# EAGLE design oblatkovac (EAGLE 9.6.2)
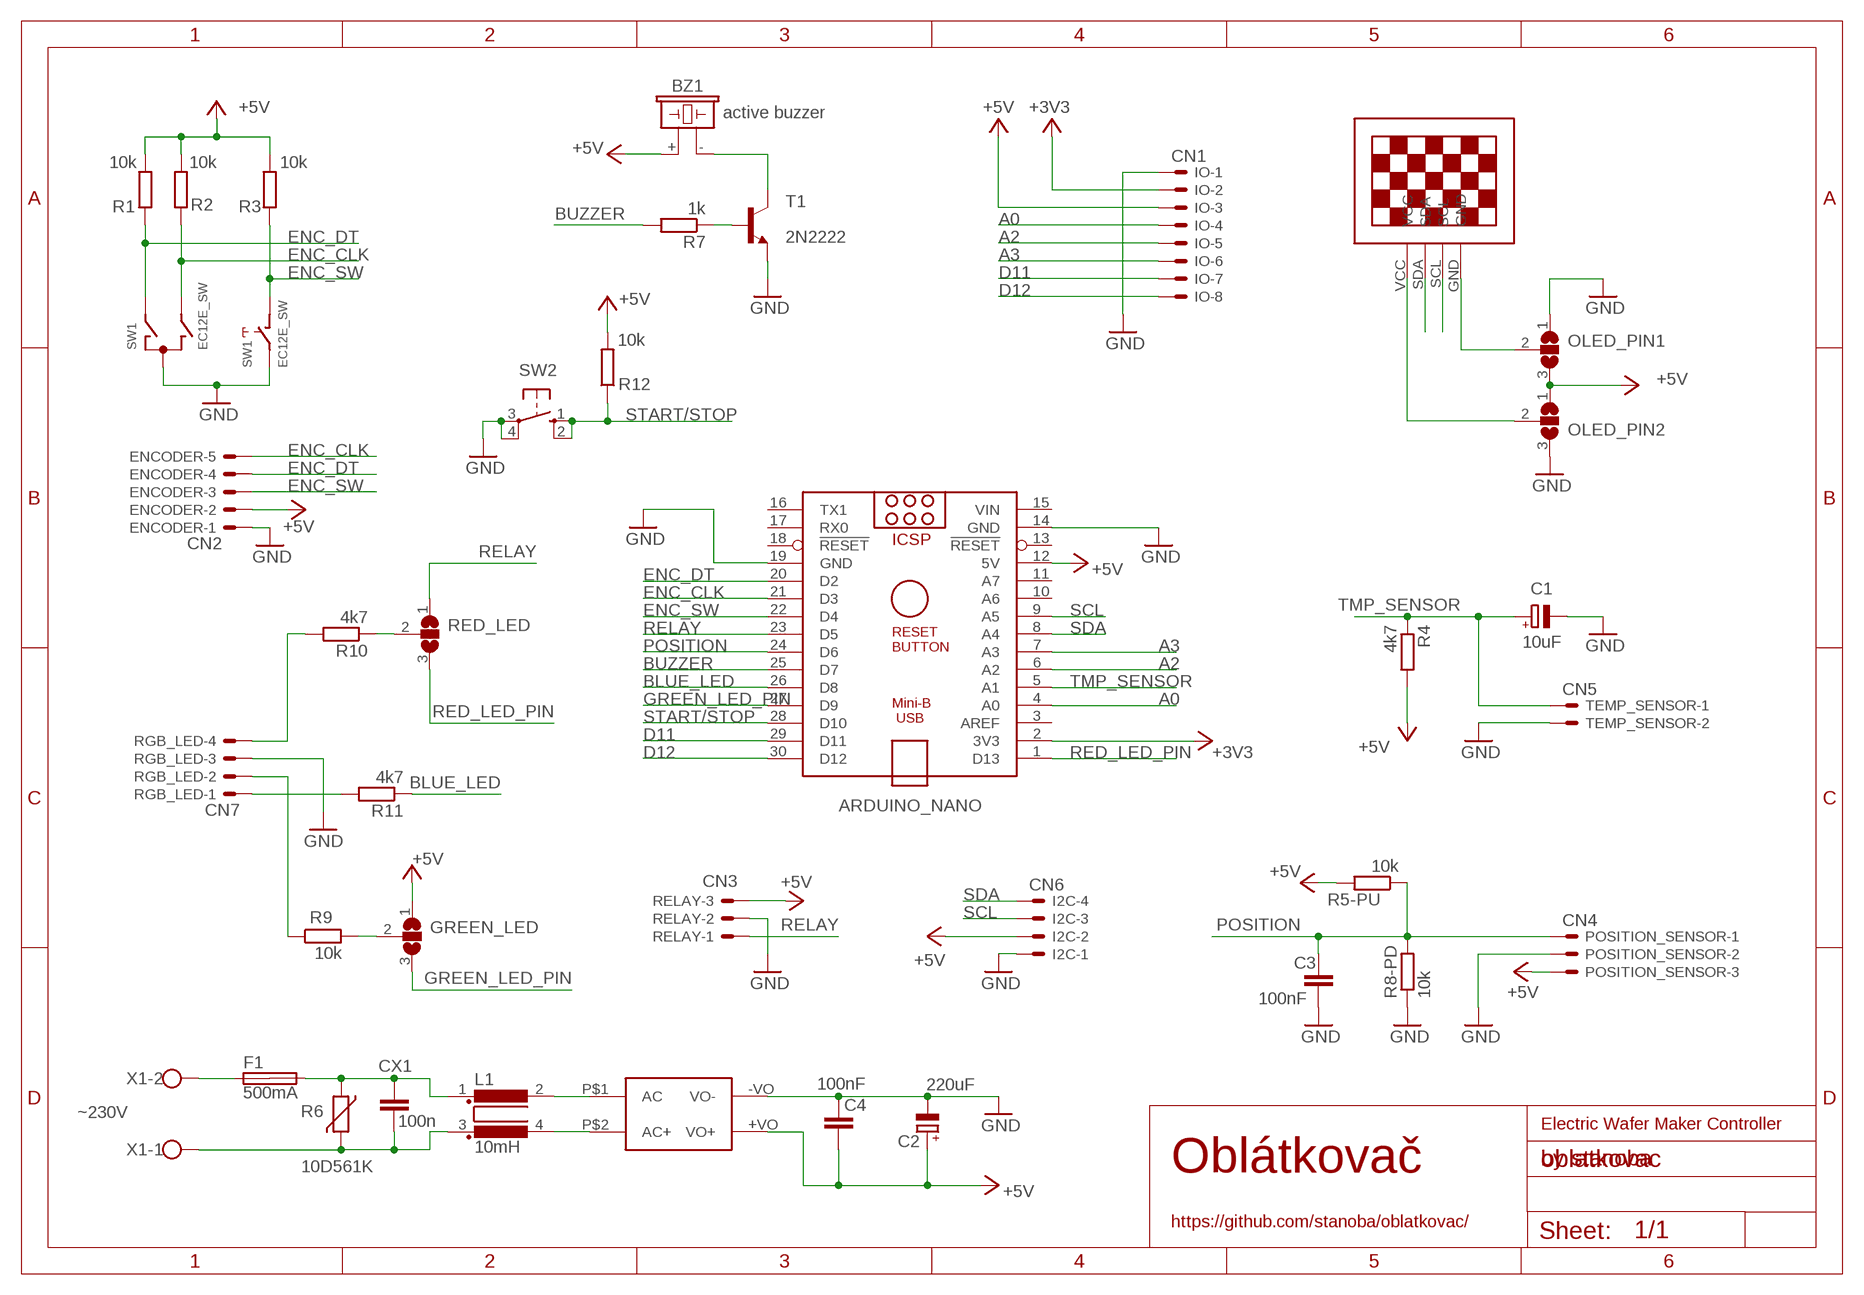
[diagram p0: schematic, sheet 1]

## Parts
ARDUINO_NANO  ARDUINO_NANO  [ARDUINO_NANO]
BZ1  active buzzer  F/CM12P  [F/CM12P]
C1  10uF  CPOL-EUE5-6  [E5-6]
C2  220uF  CPOL-EUE5-10.5  [E5-10,5]
C3  100nF  C-EU050-024X044  [C050-024X044]
C4  100nF  C-EU050-024X044  [C050-024X044]
CX1  100n  CXXC10B6  [XC10B6]
ENCODER  CN2  JST-XH-05-PIN-LONG-PAD  [JST-XH-05-PACKAGE-LONG-PAD]
F1  500mA  SHK20L  [SHK20L]
GREEN_LED  SJ2W  [SJ_2]
I2C  CN6  JST-XH-04-PIN-LONG-PAD  [JST-XH-04-PACKAGE-LONG-PAD]
IO  CN1  JST-XH-08-PIN-LONG-PAD  [JST-XH-08-PACKAGE-LONG-PAD]
L1  10mH  R1405XB2  [B2]
OLED_PIN1  SJ2W  [SJ_2]
OLED_PIN2  SJ2W  [SJ_2]
POSITION_SENSOR  CN4  JST-XH-03-PIN-LONG-PAD  [JST-XH-03-PACKAGE-LONG-PAD]
R1  10k  R-EU_0207/10  [0207/10]
R2  10k  R-EU_0207/10  [0207/10]
R3  10k  R-EU_0207/10  [0207/10]
R4  4k7  R-EU_0207/10  [0207/10]
R5-PU  10k  R-EU_0207/10  [0207/10]
R6  10D561K  VARISTOR-7,5  [R-7,5]
R7  1k  R-EU_0207/10  [0207/10]
R8-PD  10k  R-EU_0207/10  [0207/10]
R9  10k  R-EU_0207/10  [0207/10]
R10  4k7  R-EU_0207/10  [0207/10]
R11  4k7  R-EU_0207/10  [0207/10]
R12  10k  R-EU_0207/10  [0207/10]
RED_LED  SJ2W  [SJ_2]
RELAY  CN3  JST-XH-03-PIN-LONG-PAD  [JST-XH-03-PACKAGE-LONG-PAD]
RGB_LED  CN7  JST-XH-04-PIN-LONG-PAD  [JST-XH-04-PACKAGE-LONG-PAD]
SW1  EC12E_SW  [ALPS_EC12E_SW]
SW2  10-XX  [B3F-10XX]
T1  2N2222  -NPN-TO92-EBC  [TO92-EBC]
TEMP_SENSOR  CN5  JST-XH-02-PIN-LONG-PAD  [JST-XH-02-PACKAGE-LONG-PAD]
U$1  13"OLED13"OLED  [1.3"OLED]
U$2  HLK-5M05  [HLK-5M05]
X1  ~230V  W237-102  [W237-102]

## Nets
+3V3: ARDUINO_NANO.2(3V3) IO.2
+5V [5V]: ARDUINO_NANO.12(5V) BZ1.+ C2.+ C4.2 ENCODER.2 GREEN_LED.1 I2C.2 IO.3 OLED_PIN1.3 OLED_PIN2.1 POSITION_SENSOR.3 R1.2 R2.2 R3.2 R4.2 R5-PU.2 R12.2 RELAY.3 U$2.+VO(VO+)
A0: ARDUINO_NANO.4(A0) IO.4
A2: ARDUINO_NANO.6(A2) IO.5
A3: ARDUINO_NANO.7(A3) IO.6
BLUE_LED: ARDUINO_NANO.26(D8) R11.1
BUZZER: ARDUINO_NANO.25(D7) R7.2
D11: ARDUINO_NANO.29(D11) IO.7
D12: ARDUINO_NANO.30(D12) IO.8
ENC_CLK: ARDUINO_NANO.21(D3) ENCODER.5 R2.1 SW1.B
ENC_DT: ARDUINO_NANO.20(D2) ENCODER.4 R1.1 SW1.A
ENC_SW: ARDUINO_NANO.22(D4) ENCODER.3 R3.1 SW1.D
GND [GND]: ARDUINO_NANO.14(GND) ARDUINO_NANO.19(GND) C1.- C2.- C3.2 C4.1 ENCODER.1 I2C.1 IO.1 OLED_PIN1.1 OLED_PIN2.3 POSITION_SENSOR.2 R8-PD.1 RELAY.2 RGB_LED.3 SW1.C SW1.E SW2.3(P) SW2.4(P1) T1.E TEMP_SENSOR.2 U$2.-VO(VO-)
GREEN_LED_PIN: ARDUINO_NANO.27(D9) GREEN_LED.3
LIVE_FUSED [high voltage]: F1.1A X1.2
LIVE_FUSED2 [high voltage]: CX1.1 F1.2A L1.1 R6.1
LIVE_FUSED3 [high voltage]: L1.2 U$2.P$1(AC)
N$1: R11.2 RGB_LED.1
N$2: GREEN_LED.2 R9.2
N$5: R9.1 RGB_LED.2
N$6: R10.2 RGB_LED.4
N$11: BZ1.- T1.C
N$12: R7.1 T1.B
N$14: R10.1 RED_LED.2
NEUTRAL [high voltage]: CX1.2 L1.3 R6.2 X1.1
NEUTRAL2 [high voltage]: L1.4 U$2.P$2(AC+)
OLED_PIN1: OLED_PIN1.2 U$1.GND
OLED_PIN2: OLED_PIN2.2 U$1.VCC
POSITION: ARDUINO_NANO.24(D6) C3.1 POSITION_SENSOR.1 R5-PU.1 R8-PD.2
RED_LED_PIN: ARDUINO_NANO.1(D13) RED_LED.3
RELAY: ARDUINO_NANO.23(D5) RED_LED.1 RELAY.1
SCL: ARDUINO_NANO.9(A5) I2C.3 U$1.SCL
SDA: ARDUINO_NANO.8(A4) I2C.4 U$1.SDA
START/STOP: ARDUINO_NANO.28(D10) R12.1 SW2.1(S) SW2.2(S1)
TMP_SENSOR: ARDUINO_NANO.5(A1) C1.+ R4.1 TEMP_SENSOR.1
Unconnected: ARDUINO_NANO.3(AREF) ARDUINO_NANO.10(A6) ARDUINO_NANO.11(A7) ARDUINO_NANO.13(!RESET) ARDUINO_NANO.16(TX1) ARDUINO_NANO.17(RX0) ARDUINO_NANO.18(!RESET) F1.1B F1.2B SW1.GND1(G) SW1.GND2(G)

## Notes on the sheet
- Electric Wafer Maker Controller
- by stanoba
- Oblátkovač
- https://github.com/stanoba/oblatkovac/

## Power pins joined to a net without a drawn wire
VIN: ARDUINO_NANO.15(VIN)

## Library data of the parts
ARDUINO_NANO = ArduinoNanoV30:ARDUINO_NANO: Arduino Nano V3.0 Overview: The Arduino Nano is a small, complete, and breadboard-friendly board based on the ATmega328 (Arduino Nano 3.x) or ATmega168 (Arduino Nano 2.x). It has more or less the same functionality of the Arduino Duemilanove, but in a different package. It lacks only a DC power jack, and works with a Mini-B USB cable instead of a standard one. The Nano was designed and is being produced by Gravitech. Specifications: Microcontroller Atmel ATmega168 or ATmega328 Operating Voltage (logic level) 5 V Input Voltage (recommended) 7-12 V Input Voltage (limits) 6-20 V Digital I/O Pins 14 (of which 6 provide PWM output) Analog Input Pins 8 DC Current per I/O Pin 40 mA Flash Memory 16 KB (ATmega168) or 32 KB (ATmega328) of which 2 KB used by bootloader SRAM 1 KB (ATmega168) or 2 KB (ATmega328) EEPROM 512 bytes (ATmega168) or 1 KB (ATmega328) Clock Speed 16 MHz Dimensions 0.73" x 1.70" Length 45 mm Width 18 mm Weigth 5 g Power: The Arduino Nano can be powered via the Mini-B USB connection, 6-20V unregulated external power supply (pin 30), or 5V regulated external power supply (pin 27). The power source is automatically selected to the highest voltage source. Memory: The ATmega168 has 16 KB of flash memory for storing code (of which 2 KB is used for the bootloader); the ATmega328 has 32 KB, (also with 2 KB used for the bootloader). The ATmega168 has 1 KB of SRAM and 512 bytes of EEPROM (which can be read and written with the EEPROM library); the ATmega328 has 2 KB of SRAM and 1 KB of EEPROM. Input and Output: Each of the 14 digital pins on the Nano can be used as an input or output, using pinMode(), digitalWrite(), and digitalRead() functions. They operate at 5 volts. Each pin can provide or receive a maximum of 40 mA and has an internal pull-up resistor (disconnected by default) of 20-50 kOhms. In addition, some pins have specialized functions. Visit Arduino - ArduinoBoardNano <https://www.arduino.cc/en/Main/ArduinoBoardNano>
BZ1 = buzzer:F/CM12P: BUZZER Source: Buerklin; OC_FARNELL: unknown; OC_NEWARK: unknown
C1 C2 = rcl:CPOL-EU: POLARIZED CAPACITOR, European symbol; SPICEPREFIX: C
C3 C4 = rcl:C-EU: CAPACITOR, European symbol; SPICEPREFIX: C
CX1 = rcl:CX: X CAPACITOR for power line; SPICEPREFIX: C
ENCODER = Rembrandt Electronics - JST XH Connectors v1-0:JST-XH-05-PIN: JST XH Connector 2 Pin Wire to board connector. Pitch: 2,54 mm, (0.100") Number of pins: 5 Created by Rembrandt Electronics www.rembrandtelectronics.com
F1 = fuse:SHK20L: FUSE HOLDER 5 x 20 mm, SH contact, SHH1 Schukat, E1073 Buerklin; OC_FARNELL: unknown; OC_NEWARK: unknown
GREEN_LED OLED_PIN1 OLED_PIN2 RED_LED = jumper:SJ2W: SMD solder JUMPER
I2C RGB_LED = Rembrandt Electronics - JST XH Connectors v1-0:JST-XH-04-PIN: JST XH Connector 2 Pin Wire to board connector. Pitch: 2,54 mm, (0.100") Number of pins: 4 Created by Rembrandt Electronics www.rembrandtelectronics.com
IO = Rembrandt Electronics - JST XH Connectors v1-0:JST-XH-08-PIN: JST XH Connector 2 Pin Wire to board connector. Pitch: 2,54 mm, (0.100") Number of pins: 8 Created by Rembrandt Electronics www.rembrandtelectronics.com
L1 = inductor-nkl:R1405X: Gleichtakt-Entstördrossel (bis typ. 10MHz) common mode choke (up to typ. 10MHz); OC_FARNELL: unknown; OC_NEWARK: unknown
POSITION_SENSOR RELAY = Rembrandt Electronics - JST XH Connectors v1-0:JST-XH-03-PIN: JST XH Connector 2 Pin Wire to board connector. Pitch: 2,54 mm, (0.100") Number of pins: 3 Created by Rembrandt Electronics www.rembrandtelectronics.com
R1-R4 R5-PU R7 R8-PD R9-R12 = rcl:R-EU_: RESISTOR, European symbol; SPICEPREFIX: R
R6 = varistor:VARISTOR: VARISTOR
SW1 = switch-alps:EC12E_SW: ALPS rotary Encoder EC12E series with switch; MPN: EC12E2424407; OC_FARNELL: 1520813; OC_NEWARK: 74M1068
SW2 = switch-omron:10-XX: OMRON SWITCH; MPN: B3F-1000; OC_FARNELL: 176432; OC_NEWARK: 36M3542
T1 = transistor:*-NPN-: NPN Transistror BF959 corrected 2008.03.06
TEMP_SENSOR = Rembrandt Electronics - JST XH Connectors v1-0:JST-XH-02-PIN: JST XH Connector 2 Pin Wire to board connector. Pitch: 2,54 mm, (0.100") Number of pins: 2 Created by Rembrandt Electronics www.rembrandtelectronics.com
U$1 = 13oled:13"OLED
U$2 = mastrogippo:HLK-5M05
X1 = con-wago-500:W237-102: WAGO SCREW CLAMP; MPN: 237-102; OC_FARNELL: unknown; OC_NEWARK: 70K9898

## Net classes
0 default: clearance 0.3 mm
1 high voltage: width 4 mm, clearance 1.5 mm
2 5V: width 1 mm, clearance 0.3 mm
3 GND: width 1 mm, clearance 0.3 mm

## Board
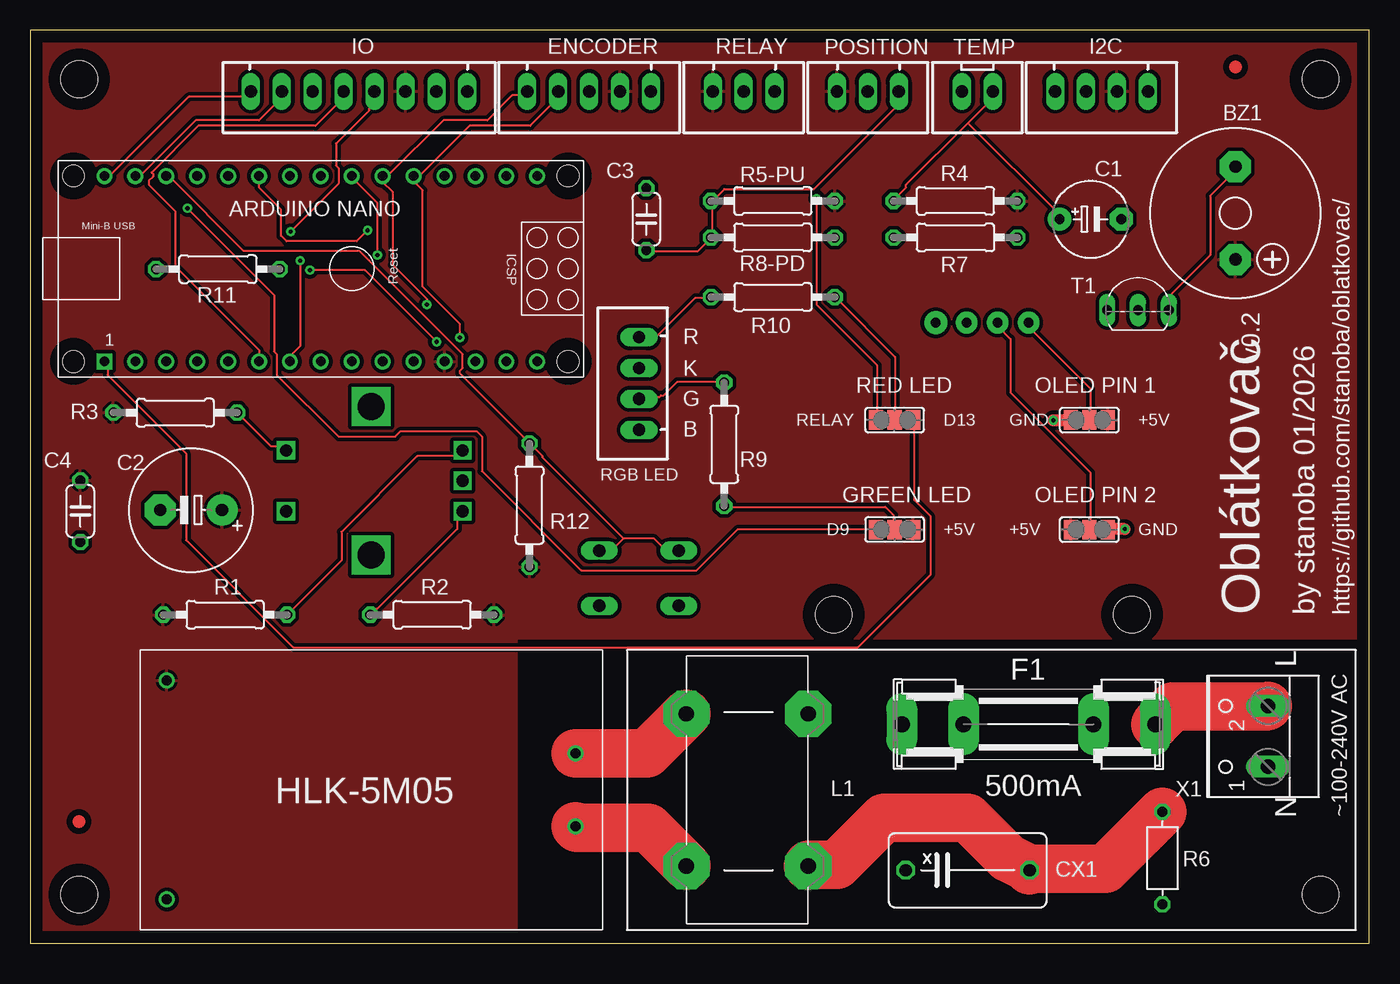
[diagram p1: board, top side]
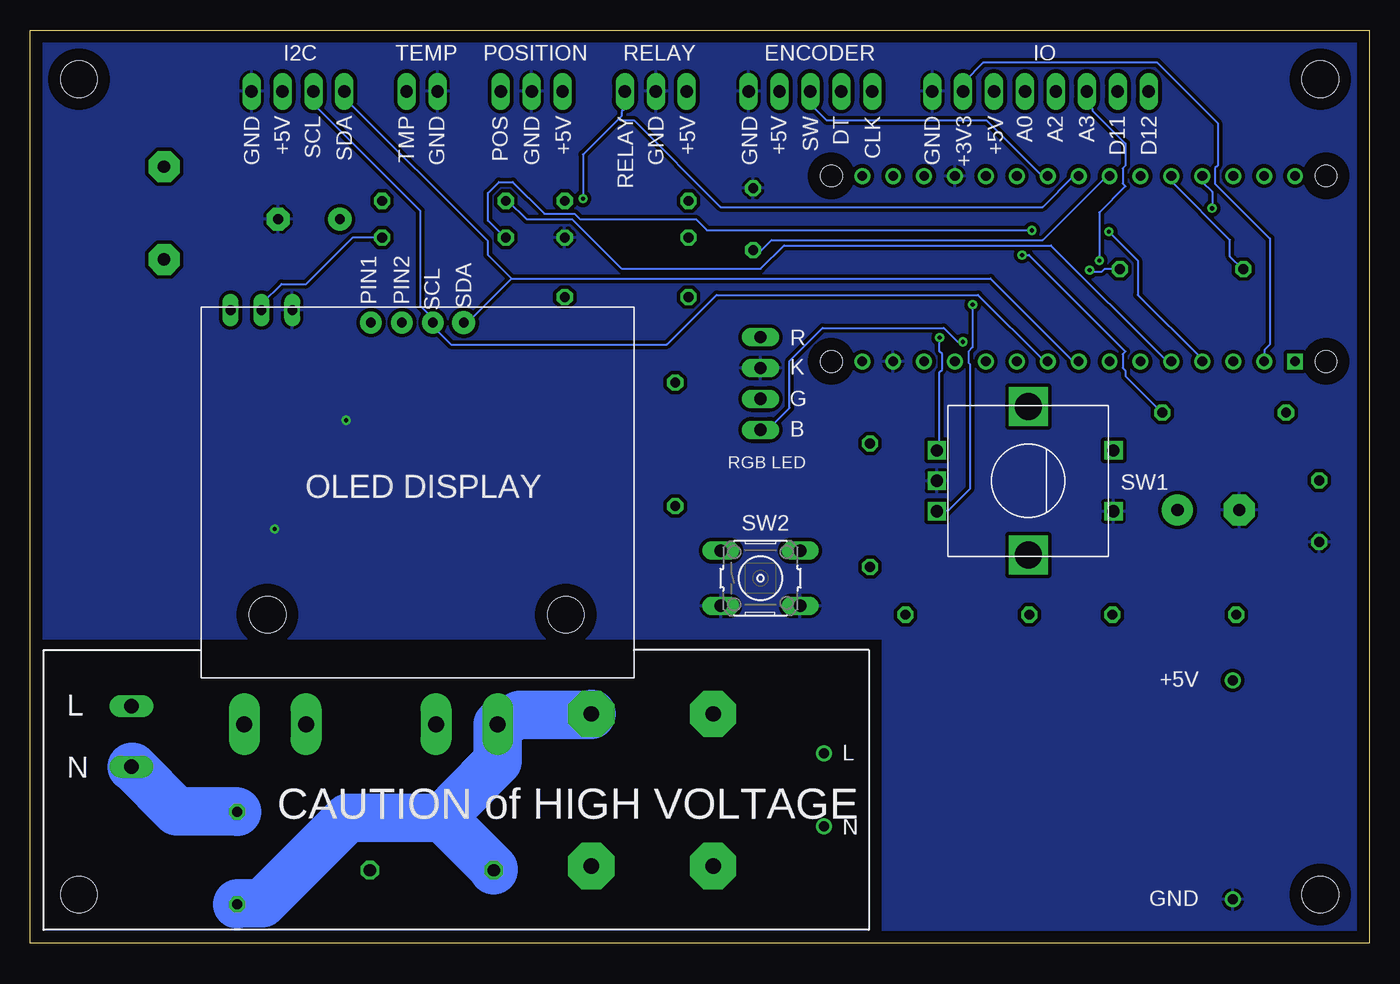
[diagram p2: board, bottom side, seen from below]

Size 109.98 x 75.01 mm. Coordinates in mm from the lower left corner, seen from the top.
Outline: 0,0 109.98,0 109.98,75.01 0,75.01 0,0
Copper layers (1*16): Top 0.035mm / dielectric 1.5mm / Bottom 0.035mm
Design rules "default": minimum track width 6mil, minimum drill 0.35mm, track to track 6mil, track to pad 6mil, pad to pad 6mil, via to via 6mil, smd to smd 6mil, copper to edge 40mil, drill to drill 6mil, minimum pad ring 10mil, minimum via ring 8mil, stop-mask expansion 4mil, vias tented up to drill 0mil, thermal gap 10mil
Holes 3 mm at 4,4 4,71 106,4 106,71 66,27 90.5,27

### Footprints (pad centres in the part's own frame; a part is rotated, then mirrored left to right if it is on the bottom)
ARDUINO_NANO = drill 0.8 square: 1 -20.32,-7.62 | drill 0.8: 2 -17.78,-7.62; 3 -15.24,-7.62; 4 -12.7,-7.62; 5 -10.16,-7.62; 6 -7.62,-7.62; 7 -5.08,-7.62; 8 -2.54,-7.62; 9 0,-7.62; 10 2.54,-7.62; 11 5.08,-7.62; 12 7.62,-7.62; 13 10.16,-7.62; 14 12.7,-7.62; 15 15.24,-7.62; 16 15.24,7.62; 17 12.7,7.62; 18 10.16,7.62; 19 7.62,7.62; 20 5.08,7.62; 21 2.54,7.62; 22 0,7.62; 23 -2.54,7.62; 24 -5.08,7.62; 25 -7.62,7.62; 26 -10.16,7.62; 27 -12.7,7.62; 28 -15.24,7.62; 29 -17.78,7.62; 30 -20.32,7.62 | hole 1.778: -22.86,-7.62; -22.86,7.62; 17.78,7.62; 17.78,-7.62
F/CM12P = drill 1.016 pad 2.54 octagon: + 3.81,0; - -3.81,0
E5-6 = drill 0.813 pad 1.905: + -2.54,0 | drill 0.813 pad 1.905 octagon: - 2.54,0
E5-10,5 = drill 1.016 pad 2.54: + -2.54,0 | drill 1.016 pad 2.54 octagon: - 2.54,0
C050-024X044 = drill 0.813 octagon: 1 -2.54,0; 2 2.54,0
XC10B6 = drill 1.016 octagon: 1 -5.08,0; 2 5.08,0
JST-XH-05-PACKAGE-LONG-PAD = drill 1.016 long: 1 -5.08,0; 2 -2.54,0; 3 0,0; 4 2.54,0; 5 5.08,0
SHK20L = drill 1.321 pad 2.54 long: 1A -10.414,0; 1B -5.334,0; 2A 10.414,0; 2B 5.334,0
SJ_2 = smd 1.168 x 1.6: 1 -1.524,0; 2 0,0; 3 1.524,0
JST-XH-04-PACKAGE-LONG-PAD = drill 1.016 long: 1 -3.81,0; 2 -1.27,0; 3 1.27,0; 4 3.81,0
JST-XH-08-PACKAGE-LONG-PAD = drill 1.016 long: 1 -8.89,0; 2 -6.35,0; 3 -3.81,0; 4 -1.27,0; 5 1.27,0; 6 3.81,0; 7 6.35,0; 8 8.89,0
B2 = drill 1.27 pad 3.81 octagon: 1 -6.25,5; 2 -6.25,-5; 3 6.25,5; 4 6.25,-5
JST-XH-03-PACKAGE-LONG-PAD = drill 1.016 long: 1 -2.54,0; 2 0,0; 3 2.54,0
0207/10 = drill 0.813 octagon: 1 -5.08,0; 2 5.08,0
R-7,5 = drill 0.813 octagon: 1 -3.81,0; 2 3.81,0
ALPS_EC12E_SW = drill 1 square: A -2.5,-7.5; B 2.5,-7.5; C 0,-7.5; D -2.5,7; E 2.5,7 | drill 2.2 square: GND1 -6.1,0; GND2 6.1,0
B3F-10XX = drill 1.016 long: 1 -3.251,2.261; 2 3.251,2.261; 3 -3.251,-2.261; 4 3.251,-2.261
TO92-EBC = drill 0.813 long: B 0,-1.27; C 2.54,-1.27; E -2.54,-1.27
JST-XH-02-PACKAGE-LONG-PAD = drill 1.016 long: 1 -1.27,0; 2 1.27,0
1.3"OLED = drill 0.8 pad 1.778: GND 0,0; SCL 5.08,0; VCC 2.54,0 | drill 0.8 pad 1.9: SDA 7.62,0
HLK-5M05 = drill 0.813: +VO 35.8,2.5; -VO 35.8,20.5; P$1 2.2,8.5; P$2 2.2,14.5
W237-102 = drill 1.194 long: 1 -2.5,-1.27; 2 2.5,-1.27

### Placement (x,y rotation side)
ARDUINO_NANO  26.4,55.43 0 top
BZ1  99,60 270 top
C1  87.1,59.5 0 top
C2  13.2,35.6 180 top
C3  50.6,59.5 90 top
C4  4.1,35.5 90 top
CX1  77,6 0 top
ENCODER  45.9,70 180 top
F1  82,18 180 top
GREEN_LED  71,34 180 top
I2C  88,70 180 top
IO  27,70 180 top
L1  58.9,12.6 270 top
OLED_PIN1  87,43 0 top
OLED_PIN2  87,34 0 top
POSITION_SENSOR  68.8,70 180 top
R1  16,27 180 top
R2  33,27 0 top
R3  11.9,43.6 180 top
R4  76,61 0 top
R5-PU  61,61 0 top
R6  93,7 90 top
R7  76,58 180 top
R8-PD  61,58 180 top
R9  57,41 270 top
R10  61,53.1 180 top
R11  15.4,55.4 0 top
R12  41,36 270 top
RED_LED  71,43 0 top
RELAY  58.6,70 180 top
RGB_LED  50,46 90 top
SW1  28,38 270 bottom
SW2  50,30 0 bottom
T1  91,53.3 0 top
TEMP_SENSOR  77.8,70 180 top
U$1  82,51 0 bottom
U$2  47,24.1 180 top
U$3  FIDUCIAL  [FIDUCIAL]  4,10 0 top
U$4  FIDUCIAL  [FIDUCIAL]  99,72 0 top
X1  100.4,17 90 top

### Tracks (layer width: path | path; a pad name or v marks a point on that pad's centre or on a via)
+3V3
  Bottom 0.152: ARDUINO_NANO.2 8.6,47.84 8.6,48.75 8.14,49.2 8.14,57.91 12.67,62.43 12.67,63.67 12.44,63.9 12.44,67.41 17.42,72.38 31.67,72.38 33.25,70.8 33.25,70.01 IO.2
+5V
  pour Top: 0,75 0,0 40,0 40,25 110,25 110,75
A0  (via drill 0.35)
  Top 0.152: v21.38,58.47 25.33,62.43 25.33,63.67 25.11,63.9 25.11,65.71 27.82,68.42 27.82,68.54 28.16,68.88 28.16,69.9 IO.4
  Bottom 0.152: v21.38,58.47 19,56.1 19,53.27 13.8,48.07 13.8,47.84 ARDUINO_NANO.4
A2
  Top 0.152: ARDUINO_NANO.6 18.77,47.84 18.77,48.75 11.88,55.65 11.88,60.17 9.73,62.32 9.73,62.66 10.07,63 10.07,63.22 9.95,63.34 13.8,67.18 23.41,67.18 25.67,69.44 25.67,69.9 IO.5
A3  (via drill 0.35)
  Top 0.152: v22.17,56.1 22.17,49.09 21.38,48.29 21.38,47.84 ARDUINO_NANO.7
  Bottom 0.152: v22.17,56.1 22.17,60.06 20.02,62.2 20.25,62.43 20.25,63.67 20.02,63.9 20.02,65.71 22.73,68.42 22.73,68.54 23.19,68.99 23.19,69.9 IO.6
BLUE_LED
  Bottom 0.152: ARDUINO_NANO.26 16.17,63 16.17,62.54 11.42,57.79 11.42,56.44 10.4,55.42 R11.1
BUZZER  (via drill 0.35)
  Top 0.152: v27.71,58.59 26.8,57.68 21.04,57.68 20.58,58.13 20.58,60.28 18.77,62.09 18.77,63 ARDUINO_NANO.25
  Bottom 0.152: v27.71,58.59 54.4,58.59 55.31,59.49 64.81,59.49 65.26,59.94 67.75,59.94 70.35,62.54 71.48,62.54 72.38,61.64 72.38,59.38 71.03,58.02 R7.2
D11
  Top 0.152: ARDUINO_NANO.29 8.71,63.11 9.05,63.11 13.57,67.63 18.77,67.63 20.58,69.44 20.58,69.9 IO.7
D12
  Top 0.152: ARDUINO_NANO.30 6.11,63.11 6.56,63.11 13.01,69.56 17.76,69.56 18.1,69.9 IO.8
ENC_CLK  (via drill 0.35)
  Top 0.152: SW1.B 35.06,35.06 35.06,34.04 28.5,27.48 28.39,27.48 27.94,27.03 R2.1 | ENCODER.5 40.72,69.9 40.49,69.67 39.59,69.67 37.55,67.63 33.93,67.63 29.41,63.11 28.95,63.11 ARDUINO_NANO.21 28.95,63 28.95,62.54 29.75,61.75 29.75,55.76 32.57,52.93 v32.57,52.48
  Bottom 0.152: v32.57,52.48 32.57,48.97 32.91,48.63 32.91,47.73 32.8,47.62 32.8,37.32 34.61,35.51 35.4,35.51 SW1.B
ENC_DT  (via drill 0.35)
  Top 0.152: ENCODER.4 43.32,69.9 43.32,69.44 41.05,67.18 36.08,67.18 32.01,63.11 31.55,63.11 ARDUINO_NANO.20 31.55,63 31.55,62.54 32.23,61.87 32.23,53.95 35.29,50.9 v35.29,49.76 | R1.1 21.15,27.03 25.56,31.44 25.56,33.82 31.78,40.04 34.95,40.04 35.4,40.49 SW1.A
  Bottom 0.152: v35.29,49.76 35.29,48.63 35.06,48.41 35.06,47.16 35.29,46.94 35.29,40.72 35.4,40.6 SW1.A
ENC_SW  (via drill 0.35)
  Top 0.152: R3.1 17.08,43.54 19.79,40.83 20.7,40.83 20.92,40.6 SW1.D | v28.5,56.55 28.5,60.85 26.35,63 ARDUINO_NANO.22
  Bottom 0.152: ARDUINO_NANO.22 26.46,63.11 26.92,63.11 31.44,67.63 44.56,67.63 45.81,68.88 45.81,69.9 ENCODER.3 | v28.5,56.55 27.94,56.55 20.02,48.63 20.25,48.41 20.25,47.28 20.02,47.05 20.02,46.6 17.08,43.66 R3.1
GND  (via drill 0.35)
  Top 1: v89.92,34.04 88.56,34.04 OLED_PIN2.3 | v84.03,42.98 85.39,42.98 OLED_PIN1.1
  pour Bottom: 0,75 0,0 40,0 40,25 110,25 110,75
GREEN_LED_PIN  (via drill 0.35)
  Top 0.152: v12.89,60.4 20.02,53.27 20.02,48.63 20.25,48.41 20.25,46.71 25.33,41.62 29.97,41.62 30.42,42.07 36.64,42.07 37.1,41.62 37.1,38.79 45.24,30.65 54.74,30.65 58.13,34.04 69.44,34.04 GREEN_LED.3
  Bottom 0.152: v12.89,60.4 12.89,61.75 13.69,62.54 13.69,63 ARDUINO_NANO.27
LIVE_FUSED
  Top 4: X1.2 101.56,19.45 93.87,19.45 92.52,18.1 F1.1A
LIVE_FUSED2
  Bottom 4: 76.12,10.29 83.92,10.29 90.93,3.28 92.97,3.28 R6.1 | 76.12,10.29 71.93,6.11 CX1.1 | 71.59,17.98 71.59,14.93 74.76,11.76 76.12,10.29 | 71.59,17.98 F1.2A | L1.1 63.9,18.77 69.78,18.77 71.59,17.98
LIVE_FUSED3
  Top 4: U$2.P$1 44.9,15.61 50.67,15.61 53.84,18.77 L1.2
N$1  (via drill 0.35)
  Top 0.152: v22.96,55.31 27.48,55.31 v33.36,49.42
  Bottom 0.152: v22.96,55.31 22.85,55.19 21.94,55.19 21.71,55.42 20.58,55.42 R11.2 | v33.36,49.42 33.82,49.42 34.95,50.56 44.9,50.56 47.62,47.84 47.62,44 49.31,42.3 49.99,42.3 RGB_LED.1
N$2
  Top 0.152: GREEN_LED.2 70.91,34.04 70.91,35.17 70.23,35.85 57,35.85 R9.2
N$5
  Top 0.152: R9.1 56.89,46.15 53.16,46.15 52.03,45.01 51.8,45.01 51.69,44.9 51.57,44.9 51.46,44.79 50.1,44.79 RGB_LED.2
N$6
  Top 0.152: R10.2 55.87,53.04 54.63,53.04 51.46,49.88 50.1,49.88 RGB_LED.4
N$11
  Top 0.152: T1.C 93.65,52.14 93.65,53.27 96.93,56.55 96.93,61.41 98.96,63.45 98.96,63.79 BZ1.-
N$12
  Bottom 0.152: R7.1 81.09,58.02 83.47,58.02 87.31,54.17 89.35,54.17 90.93,52.59 90.93,52.14 T1.B
N$14
  Top 0.152: RED_LED.2 71.03,43.09 71.03,48.18 66.16,53.04 R10.1
NEUTRAL
  Top 4: 82.11,6.11 88.33,6.11 92.97,10.74 R6.2 | 82.11,6.11 CX1.2 | L1.3 63.9,6.45 66.28,6.45 70.12,10.29 77.02,10.29 80.3,7.01 82.11,6.11
  Bottom 4: R6.2 93.08,10.86 97.94,10.86 101.56,14.48 X1.1
NEUTRAL2
  Top 4: U$2.P$2 44.9,9.5 50.78,9.5 53.84,6.45 L1.4
OLED_PIN1
  Top 0.152: OLED_PIN1.2 87.09,43.09 87.09,45.58 82.11,50.56 82.11,50.9 U$1.GND
OLED_PIN2
  Top 0.152: OLED_PIN2.2 87.09,34.04 87.09,38.68 80.53,45.24 80.53,49.65 79.51,50.67 79.51,50.9 U$1.VCC
POSITION
  Top 0.152: 55.98,60.96 55.98,58.02 R8-PD.2 55.87,57.91 54.85,56.89 50.67,56.89 C3.1 | 55.98,60.96 57,61.98 64.35,61.98 71.25,68.88 71.25,69.9 POSITION_SENSOR.1 | 55.98,60.96 R5-PU.1
  Bottom 0.152: ARDUINO_NANO.24 21.38,63 21.6,63 26.8,57.79 49.09,57.79 49.99,56.89 50.56,56.89 C3.1
RED_LED_PIN
  Top 0.152: RED_LED.3 72.61,42.98 72.61,36.42 73.97,35.06 73.97,30.31 67.97,24.32 21.6,24.32 12.78,33.14 12.78,40.26 6.33,46.71 6.33,47.5 6.11,47.73 ARDUINO_NANO.1
RELAY  (via drill 0.35)
  Top 0.152: v64.58,61.19 64.58,52.48 69.56,47.5 69.56,43.09 RED_LED.1
  Bottom 0.152: v64.58,61.19 64.58,64.81 61.64,67.75 | 61.64,67.75 61.41,67.97 61.41,68.31 61.19,68.54 61.19,69.9 RELAY.1 | 61.64,67.75 61.53,67.63 60.4,67.63 53.27,60.51 26.8,60.51 24.32,63 23.86,63 ARDUINO_NANO.23
SCL
  Bottom 0.152: ARDUINO_NANO.9 26.46,47.84 26.69,47.84 32.12,53.27 53.61,53.27 57.68,49.2 75.44,49.2 76.91,50.67 76.91,50.9 U$1.SCL 77.02,51.01 77.02,51.46 77.93,52.37 77.93,60.17 86.64,68.88 86.64,69.9 I2C.3
SDA
  Bottom 0.152: 70.46,54.63 31.1,54.63 24.32,47.84 23.86,47.84 ARDUINO_NANO.8 | 70.46,54.63 74.08,51.01 74.31,51.01 U$1.SDA | 70.46,54.63 72.38,56.55 72.38,57.68 84.15,69.44 84.15,69.9 I2C.4
START/STOP
  Top 0.152: 48.75,33.25 47.84,32.35 46.82,32.35 SW2.2 | 48.75,33.25 51.23,33.25 52.14,32.35 53.16,32.35 SW2.1 | ARDUINO_NANO.28 11.2,63 11.42,63 17.53,56.89 27.03,56.89 35.51,48.41 35.51,47.28 35.29,47.05 35.29,46.82 40.94,41.17 R12.1 41.05,41.05 42.07,40.04 42.07,39.92 48.75,33.25
TMP_SENSOR
  Top 0.152: 77.02,67.41 71.93,62.32 71.93,62.09 70.91,61.07 R4.1 | 77.02,67.41 79.06,69.44 79.06,69.9 TEMP_SENSOR.1 | 77.02,67.41 84.49,59.94 84.49,59.6 C1.+
  Bottom 0.152: ARDUINO_NANO.5 16.29,47.84 16.63,47.84 26.13,57.34 48.07,57.34 49.99,55.42 61.41,55.42 65.48,59.49 69.22,59.49 70.69,60.96 70.91,60.96 R4.1

### Text on the board
tNames: POSITION | TEMP | ARDUINO NANO | R | v0.2 | K | RED LED | OLED PIN 1 | G | B | RELAY | D13 | GND | +5V | RGB LED | GREEN LED | OLED PIN 2 | D9 | +5V | +5V | GND | Oblátkovač | by stanoba 01/2026 | https://github.com/stanoba/oblatkovac/ | L | HLK-5M05 | 500mA | N | ~100-240V AC
bNames: IO | ENCODER | RELAY | POSITION | TEMP | I2C | D12 | D11 | A3 | A2 | A0 | +5V | +3V3 | GND | CLK | DT | SW | +5V | GND | +5V | GND | RELAY | +5V | GND | POS | GND | TMP | SDA | SCL | +5V | GND | SDA | SCL | PIN2 | PIN1 | R | K | G | B | RGB LED | OLED DISPLAY | +5V | L | L | N | CAUTION of HIGH VOLTAGE | N | GND